# EAGLE design mosfet_out (EAGLE 7.2.0)
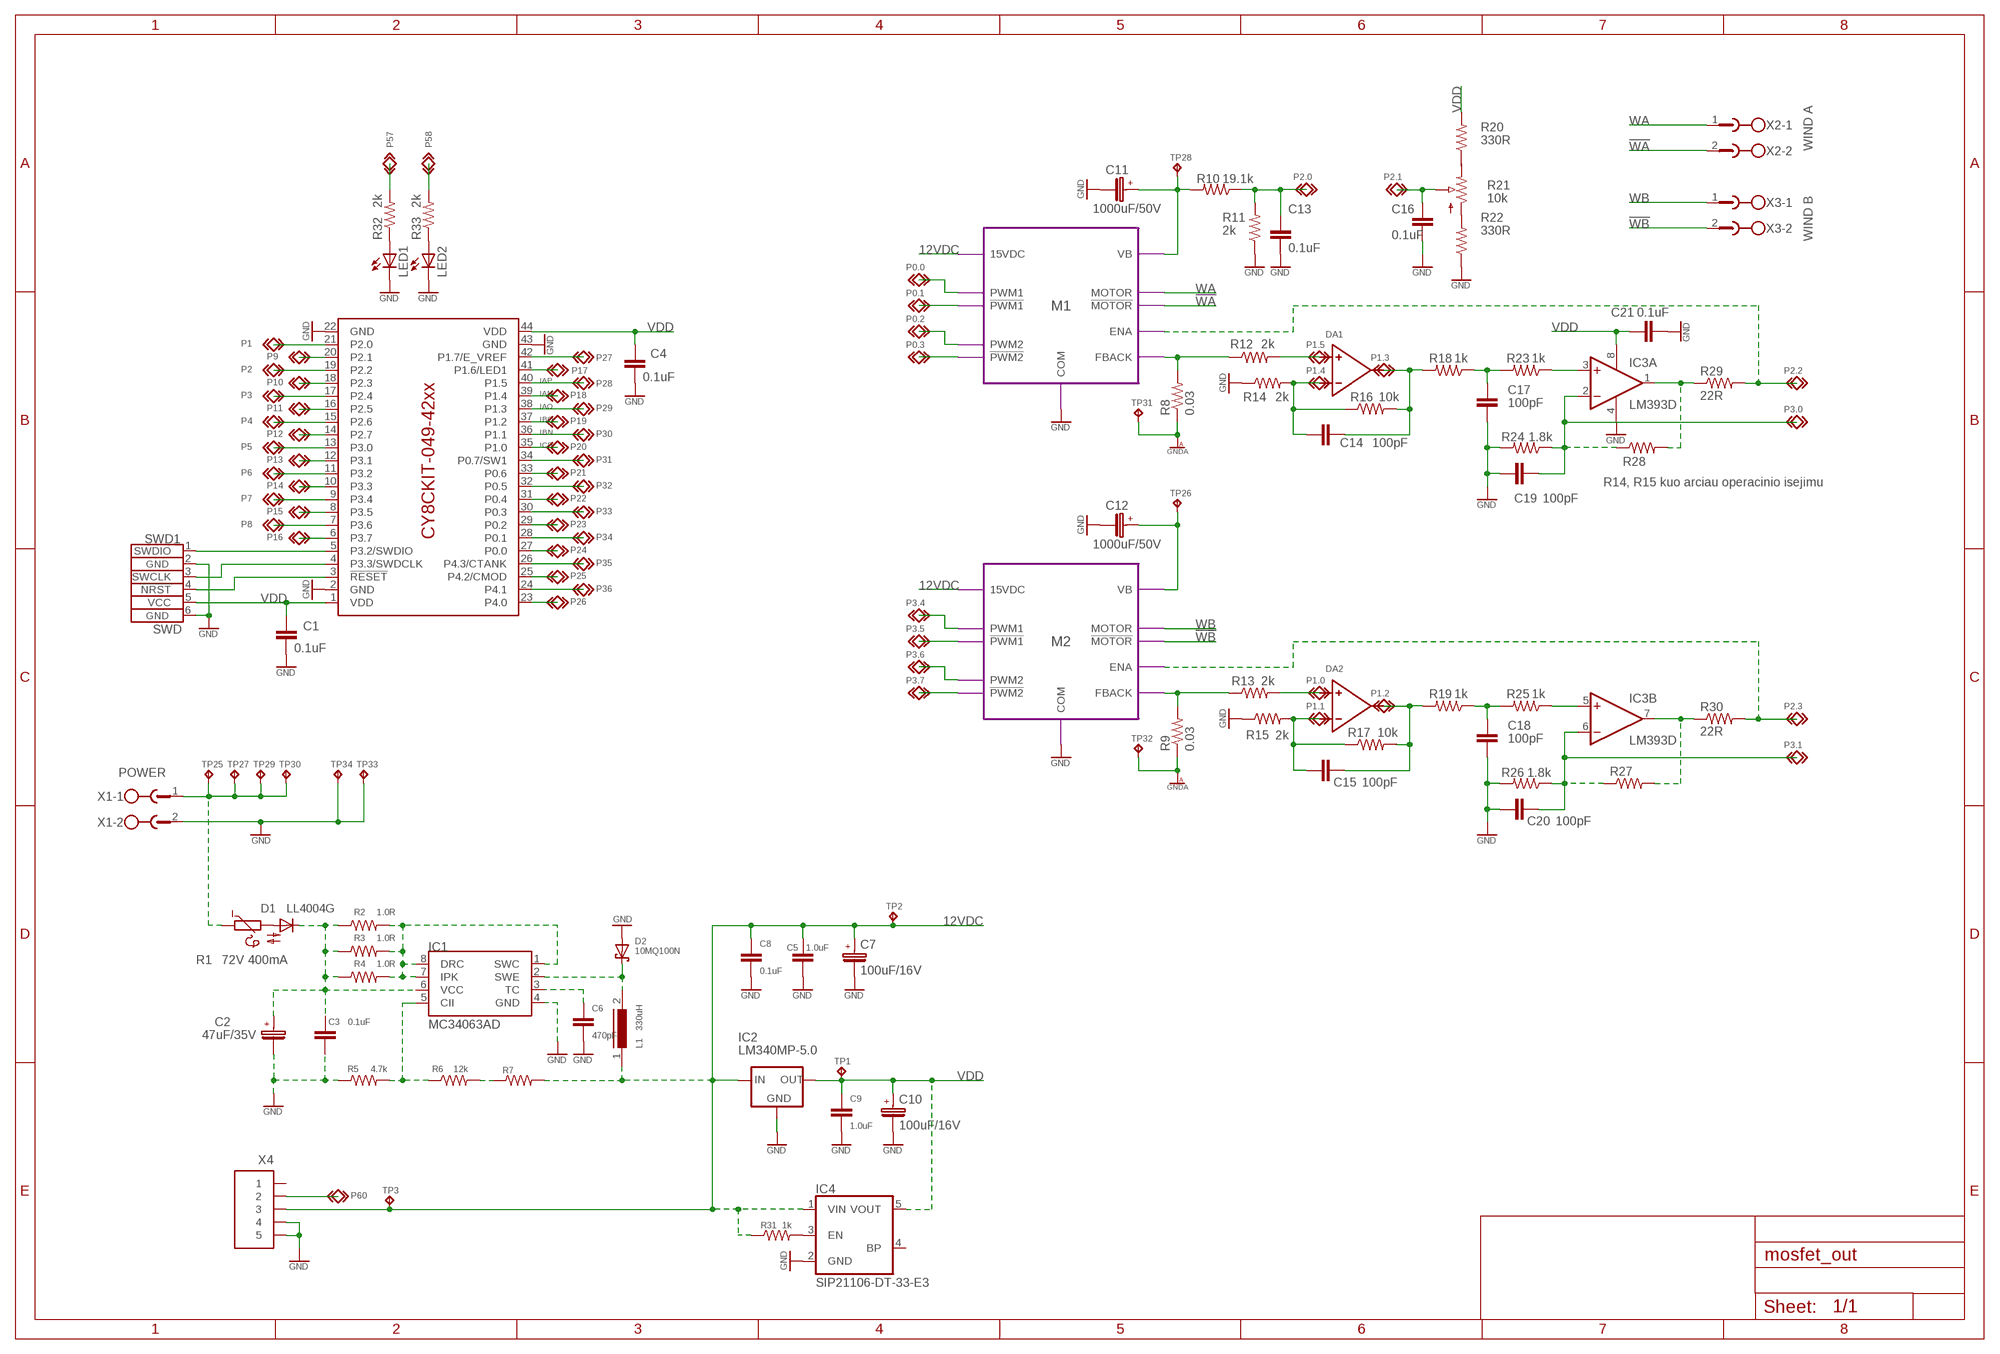
[diagram p0: schematic, sheet 1]

## Parts
C1  0.1uF  C0805-0.1UF  [C0805]
C2  47uF/35V  CPOL/2.5X6-47UF/35V  [E2,5-6]
C3  0.1uF  C0805-0.1UF  [C0805]
C4  0.1uF  C0805-0.1UF  [C0805]
C5  1.0uF  C1206-1UF  [C1206]
C6  470pF  C0805-470PF  [C0805]
C7  100uF/16V  CPOL/2.5X6-100UF/16V  [E2,5-6]
C8  0.1uF  C0805-0.1UF  [C0805]
C9  1.0uF  C1206-1UF  [C1206]
C10  100uF/16V  CPOL/2.5X6-100UF/16V  [E2,5-6]
C11  1000uF/50V  CPOL/5X13-1000UF/50V  [E5-13]
C12  1000uF/50V  CPOL/5X13-1000UF/50V  [E5-13]
C13  0.1uF  C0805-0.1UF  [C0805]
C14  100pF  C0805-100PF  [C0805]
C15  100pF  C0805-100PF  [C0805]
C16  0.1uF  C0805-0.1UF  [C0805]
C17  100pF  C0805-100PF  [C0805]
C18  100pF  C0805-100PF  [C0805]
C19  100pF  C0805-100PF  [C0805]
C20  100pF  C0805-100PF  [C0805]
C21  0.1uF  C0805-0.1UF  [C0805]
D1  LL4004G  DSW-LL4004/MELF  [MELF-MLL41]
D2  10MQ100N  DSH-10MQ100/DO214AC  [DO214AC]
IC1  MC34063AD  [SO08]
IC2  LM340MP-5.0  LM340  [SOT223]
IC3  LM393D  [SO08]
IC4  SIP21106-DT-33-E3  SIP21106DT  [SOT25]
L1  330uH  LSDR7045-330UH  [DR7045]
LED1  LED-GREEN-3MM  [LED3MM]
LED2  LED-GREEN-3MM  [LED3MM]
P0.0  CONT_1.2MM  [TP1.2X1.2]
P0.1  CONT_1.2MM  [TP1.2X1.2]
P0.2  CONT_1.2MM  [TP1.2X1.2]
P0.3  CONT_1.2MM  [TP1.2X1.2]
P1  CONT_1.5MM  [TP1.5X1.5]
P1.0  CONT_1.2MM  [TP1.2X1.2]
P1.1  CONT_1.2MM  [TP1.2X1.2]
P1.2  CONT_1.2MM  [TP1.2X1.2]
P1.3  CONT_1.2MM  [TP1.2X1.2]
P1.4  CONT_1.2MM  [TP1.2X1.2]
P1.5  CONT_1.2MM  [TP1.2X1.2]
P2  CONT_1.5MM  [TP1.5X1.5]
P2.0  CONT_1.5MM  [TP1.5X1.5]
P2.1  CONT_1.5MM  [TP1.5X1.5]
P2.2  CONT_1.2MM  [TP1.2X1.2]
P2.3  CONT_1.2MM  [TP1.2X1.2]
P3  CONT_1.5MM  [TP1.5X1.5]
P3.0  CONT_1.2MM  [TP1.2X1.2]
P3.1  CONT_1.2MM  [TP1.2X1.2]
P3.4  CONT_1.2MM  [TP1.2X1.2]
P3.5  CONT_1.2MM  [TP1.2X1.2]
P3.6  CONT_1.2MM  [TP1.2X1.2]
P3.7  CONT_1.2MM  [TP1.2X1.2]
P4  CONT_1.5MM  [TP1.5X1.5]
P5  CONT_1.5MM  [TP1.5X1.5]
P6  CONT_1.5MM  [TP1.5X1.5]
P7  CONT_1.5MM  [TP1.5X1.5]
P8  CONT_1.5MM  [TP1.5X1.5]
P9  CONT_1.5MM  [TP1.5X1.5]
P10  CONT_1.5MM  [TP1.5X1.5]
P11  CONT_1.5MM  [TP1.5X1.5]
P12  CONT_1.5MM  [TP1.5X1.5]
P13  CONT_1.5MM  [TP1.5X1.5]
P14  CONT_1.5MM  [TP1.5X1.5]
P15  CONT_1.5MM  [TP1.5X1.5]
P16  CONT_1.5MM  [TP1.5X1.5]
P17  CONT_1.5MM  [TP1.5X1.5]
P18  CONT_1.5MM  [TP1.5X1.5]
P19  CONT_1.5MM  [TP1.5X1.5]
P20  CONT_1.5MM  [TP1.5X1.5]
P21  CONT_1.5MM  [TP1.5X1.5]
P22  CONT_1.5MM  [TP1.5X1.5]
P23  CONT_1.5MM  [TP1.5X1.5]
P24  CONT_1.5MM  [TP1.5X1.5]
P25  CONT_1.5MM  [TP1.5X1.5]
P26  CONT_1.5MM  [TP1.5X1.5]
P27  CONT_1.5MM  [TP1.5X1.5]
P28  CONT_1.5MM  [TP1.5X1.5]
P29  CONT_1.5MM  [TP1.5X1.5]
P30  CONT_1.5MM  [TP1.5X1.5]
P31  CONT_1.5MM  [TP1.5X1.5]
P32  CONT_1.5MM  [TP1.5X1.5]
P33  CONT_1.5MM  [TP1.5X1.5]
P34  CONT_1.5MM  [TP1.5X1.5]
P35  CONT_1.5MM  [TP1.5X1.5]
P36  CONT_1.5MM  [TP1.5X1.5]
P57  CONT_1.5MM  [TP1.5X1.5]
P58  CONT_1.5MM  [TP1.5X1.5]
P60  CONT_1.5MM  [TP1.5X1.5]
R1  72V 400mA  POLYSW-RXE040/B57164  [B57164]
R2  1.0R  R1206-1.0R-1%  [R1206]
R3  1.0R  R1206-1.0R-1%  [R1206]
R4  1.0R  R1206-1.0R-1%  [R1206]
R5  4.7k  R0805-4.7K-1%  [R0805]
R6  12k  R0805-12K-1%  [R0805]
R7  R-US_R0805  [R0805]
R8  0.03  R-US_0309/12  [0309/12]
R9  0.03  R-US_0309/12  [0309/12]
R10  19.1k  R-US_R1206  [R1206]
R11  2k  R0805-2K-1%  [R0805]
R12  2k  R0805-2K-1%  [R0805]
R13  2k  R0805-2K-1%  [R0805]
R14  2k  R0805-2K-1%  [R0805]
R15  2k  R0805-2K-1%  [R0805]
R16  10k  R0805-10K-1%  [R0805]
R17  10k  R0805-10K-1%  [R0805]
R18  1k  R0805-1K-1%  [R0805]
R19  1k  R0805-1K-1%  [R0805]
R20  330R  R0805-330R-1%  [R0805]
R21  10k  TRIM_US-CA6V  [CA6V]
R22  330R  R0805-330R-1%  [R0805]
R23  1k  R0805-1K-1%  [R0805]
R24  1.8k  R-US_R0805  [R0805]
R25  1k  R0805-1K-1%  [R0805]
R26  1.8k  R-US_R0805  [R0805]
R27  R-US_R0805  [R0805]
R28  R-US_R0805  [R0805]
R29  22R  R0805-22R-1%  [R0805]
R30  22R  R0805-22R-1%  [R0805]
R31  1k  R0805-1K-1%  [R0805]
R32  2k  R0805-2K-1%  [R0805]
R33  2k  R0805-2K-1%  [R0805]
SWD1  SWD  [ISP]
TP1  TPB1,27  [B1,27]
TP2  TPB1,27  [B1,27]
TP3  TPTP15SQ  [TP15SQ]
TP25  TPTP20SQ  [TP20SQ]
TP26  TPTP20SQ  [TP20SQ]
TP27  TPTP20SQ  [TP20SQ]
TP28  TPTP20SQ  [TP20SQ]
TP29  TPTP20SQ  [TP20SQ]
TP30  TPTP20SQ  [TP20SQ]
TP31  TPTP20SQ  [TP20SQ]
TP32  TPTP20SQ  [TP20SQ]
TP33  TPTP20SQ  [TP20SQ]
TP34  TPTP20SQ  [TP20SQ]
U1  CY8CKIT-049-42XX  [CY8CKIT-049-42XX]
X1  POWER  MSTBV2  [MSTBV2]
X2  WIND A  MSTBV2  [MSTBV2]
X3  WIND B  MSTBV2  [MSTBV2]
X4  5PIN_NS25-W5P  [6410-05]

## Module instances
M1 = M1
M2 = M1

## Nets
12VDC [power]: C5.1 C7.+ C8.1 IC2.1(IN) IC4.1(VIN) L1.1 R7.2 R31.1 TP2.PP(TP) TP3.TP X4.3 ; port M1.15VDC M2.15VDC
!WA [power+]: X2.2 ; port M1.!MOTOR
!WB [power+]: X3.2 ; port M2.!MOTOR
GND: C1.2 C2.- C3.2 C4.2 C5.2 C6.2 C7.- C8.2 C9.2 C10.- C11.- C12.- C13.2 C16.2 C17.2 C18.2 C19.2 C20.2 C21.2 D2.A IC1.4(GND) IC2.2(GND) IC2.4(GND) IC3.4(P:V-) IC4.2(GND) LED1.C LED2.C R5.1 R11.1 R14.1 R15.1 R22.1 R24.2 R26.2 SWD1.2(GND) SWD1.6(GND) TP33.TP TP34.TP U1.2(GND) U1.22(GND) U1.43(GND) X1.2 X4.4 X4.5 ; port M1.COM M2.COM
GNDA [power+]: R8.1 R9.1 TP31.TP TP32.TP
IA [power+]: R8.2 R12.1 ; port M1.FBACK
IA_KILL: P2.2.P R29.2 ; port M1.ENA
IAN: C14.2 P1.4.P P18.P R14.2 R16.1 U1.39(P1.4)
IAO: C14.1 P1.3.P P29.P R16.2 R18.2 U1.38(P1.3)
IAP: P28.P U1.40(P1.5)
IAREF: C19.1 IC3.2(A:-IN) P3.0.P R24.1 R28.1
IB [power+]: R9.2 R13.1 ; port M2.FBACK
IB_KILL: P2.3.P R30.2 ; port M2.ENA
IBN: C15.2 P1.1.P P30.P R15.2 R17.1 U1.36(P1.1)
IBO: C15.1 P1.2.P P19.P R17.2 R19.2 U1.37(P1.2)
IBREF: C20.1 IC3.6(B:-IN) P3.1.P R26.1 R27.1
ICP: P20.P U1.35(P1.0)
N$1: IC3.7(B:OUT) R27.2 R30.1
N$2: SWD1.1(SWDIO) U1.5(P3.2/SWDIO)
N$3: IC3.1(A:OUT) R28.2 R29.1
N$4: SWD1.3(SWCLK) U1.4(P3.3/SWDCLK)
N$5: IC3.3(A:+IN) R23.1
N$6: IC3.5(B:+IN) R25.1
N$7: SWD1.4(!NRST) U1.3(!RESET)
N$8: R21.A R22.2
N$9 [power]: IC1.1(SWC) IC1.7(IPK) IC1.8(DRC) R2.2 R3.2 R4.2
N$10: IC1.5(CII) R5.2 R6.1
N$11: C6.1 IC1.3(TC)
N$12: R6.2 R7.1
N$13 [power]: C2.+ C3.1 D1.C IC1.6(VCC) R2.1 R3.1 R4.1
N$14: R20.1 R21.E
N$15 [power]: D1.A R1.2
N$16 [power]: D2.C IC1.2(SWE) L1.2
N$17: C17.1 R18.1 R23.2
N$18: C18.1 R19.1 R25.2
N$19: P1.5.P R12.2
N$20: P1.0.P R13.2
N$21: P0.0.P ; port M1.PWM1
N$22: IC4.3(EN) R31.2
N$23: LED1.A R32.1
N$24: LED2.A R33.1
N$25: P0.1.P ; port M1.!PWM1
N$26: P0.2.P ; port M1.PWM2
N$27: P0.3.P ; port M1.!PWM2
N$28: P3.4.P ; port M2.PWM1
N$29: P3.5.P ; port M2.!PWM1
N$30: P3.6.P ; port M2.PWM2
N$31: P3.P U1.17(P2.4)
N$31.: P3.7.P ; port M2.!PWM2
N$33: P57.P R32.2
N$34: P58.P R33.2
N$35: P1.P U1.21(P2.0)
N$36: P9.P U1.20(P2.1)
N$37: P2.P U1.19(P2.2)
N$38: P10.P U1.18(P2.3)
N$39: P11.P U1.16(P2.5)
N$40: P4.P U1.15(P2.6)
N$41: P12.P U1.14(P2.7)
N$42: P5.P U1.13(P3.0)
N$43: P13.P U1.12(P3.1)
N$44: P6.P U1.11(P3.2)
N$45: P14.P U1.10(P3.3)
N$46: P7.P U1.9(P3.4)
N$47: P15.P U1.8(P3.5)
N$48: P8.P U1.7(P3.6)
N$49: P16.P U1.6(P3.7)
N$50: P26.P U1.23(P4.0)
N$51: P36.P U1.24(P4.1)
N$52: P25.P U1.25(P4.2/CMOD)
N$53: P35.P U1.26(P4.3/CTANK)
N$54: P24.P U1.27(P0.0)
N$55: P34.P U1.28(P0.1)
N$56: P23.P U1.29(P0.2)
N$57: P33.P U1.30(P0.3)
N$58: P22.P U1.31(P0.4)
N$59: P32.P U1.32(P0.5)
N$60: P21.P U1.33(P0.6)
N$61: P31.P U1.34(P0.7/SW1)
N$63: P60.P X4.2
N$68: P17.P U1.41(P1.6/LED1)
N$69: P27.P U1.42(P1.7/E_VREF)
SPEED: C16.1 P2.1.P R21.S
VB [power+]: C11.+ C12.+ R1.1 R10.2 TP25.TP TP26.TP TP27.TP TP28.TP TP29.TP TP30.TP X1.1 ; port M1.VB M2.VB
VBUS: C13.1 P2.0.P R10.1 R11.2
VDD [power]: C1.1 C4.1 C9.1 C10.+ C21.1 IC2.3(OUT) IC3.8(P:V+) IC4.5(VOUT) R20.2 SWD1.5(VCC) TP1.PP(TP) U1.1(VDD) U1.44(VDD)
WA [power+]: X2.1 ; port M1.MOTOR
WB [power+]: X3.1 ; port M2.MOTOR
Unconnected: IC4.4(BP) X4.1

## Notes on the sheet
- R14, R15 kuo arciau operacinio isejimu

## Library data of the parts
C1 C3 C4 C8 C13 C16 C21 = discr_lib:C?: Kondensatorius; PACK_TYPE: SMD; TYPE: X7R; VENT_CODE: ZKN065
C2 = discr_lib:CPOL?: Kondensatorius elektrolitinis; PACK_TYPE: DIP; VENT_CODE: ---
C5 C9 = discr_lib:C?: Kondensatorius; PACK_TYPE: SMD; TYPE: X7R; U: 16V; VENT_CODE: ZKN062
C6 = discr_lib:C?: Kondensatorius; PACK_TYPE: SMD; TYPE: X7R; U: 50V; VENT_CODE: ZKN087
C7 C10 = discr_lib:CPOL?: Kondensatorius elektrolitinis; PACK_TYPE: DIP; VENT_CODE: ZKN008
C11 C12 = discr_lib:CPOL?: Kondensatorius elektrolitinis; PACK_TYPE: DIP; VENT_CODE: ZKN056
C14 C15 C17-C20 = discr_lib:C?: Kondensatorius; PACK_TYPE: SMD; U: 50V; VENT_CODE: ---
D1 = discr_lib:DSW*: Diodas; PACK_TYPE: SMD; TYPE: Switch; VENT_CODE: ZELD019
D2 = discr_lib:DSH*: Shottky diodas; PACK_TYPE: SMD; PARAMS: 100V 2.1A; VENT_CODE: ZELD046
IC1 = linear_lib:MC34063: Step Up/Down impulsinio maitinimo saltinio draiveris; PACK_TYPE: SMD; VENT_CODE: ZELM041
IC2 = v-reg:LM340: Stabilizatorius; PACK_TYPE: SMD; VENT_CODE: ZELM013
IC3 = linear:LM393: Komparatorius; PACK_TYPE: SMD; VENT_CODE: ---
IC4 = v-reg:SIP2110*?: Stabilizatorius; MARK: N3; PACK_TYPE: SMD; VENT_CODE: ZELM092
L1 = discr_lib:L?: Droselis; PACK_TYPE: SMD; VENT_CODE: ZELI009
LED1 LED2 = discr_lib:LED*: Sviesos diodas; PACK_TYPE: DIP; PARAMS: Green; VENT_CODE: ZELD006
P0.0 P0.1-P0.3 P1 P1.0 P1.1-P1.5 P2 P2.0 P2.1-P2.3 P3 P3.0 P3.1 P3.4-P3.7 P4-P36 P57 P58 P60 = misc:CONT_*
R1 = discr_lib:POLYSW*: Atsistatamtis saugiklis; PACK_TYPE: DIP; VENT_CODE: ZEL062
R2-R4 = discr_lib:R?: Rezistorius; DIFF: 1%; PACK_TYPE: SMD; VENT_CODE: ZELRS019
R5 = discr_lib:R?: Rezistorius; DIFF: 1%; PACK_TYPE: SMD; VENT_CODE: ZELRS053
R6 = discr_lib:R?: Rezistorius; DIFF: 1%; PACK_TYPE: SMD; VENT_CODE: ZELRS062
R7 = rcl:R-US_: Rezistorius; PACK_TYPE: SMD
R8 R9 = rcl:R-US_: Rezistorius; PACK_TYPE: DIP; VENT_CODE: ---
R10 R24 R26-R28 = rcl:R-US_: Rezistorius; PACK_TYPE: SMD; VENT_CODE: ---
R11-R15 R32 R33 = discr_lib:R?: Rezistorius; DIFF: 1%; PACK_TYPE: SMD; VENT_CODE: ZELRS063
R16 R17 R29 R30 = discr_lib:R?: Rezistorius; DIFF: 1%; PACK_TYPE: SMD; VENT_CODE: ---
R18 R19 R23 R25 R31 = discr_lib:R?: Rezistorius; DIFF: 1%; PACK_TYPE: SMD; VENT_CODE: ZELRS061
R20 R22 = discr_lib:R?: Rezistorius; DIFF: 1%; PACK_TYPE: SMD; VENT_CODE: ZELRS018
R21 = pot:TRIM_US-: POTENTIOMETER
SWD1 = connectors:SWD: Jungtis; PACK_TYPE: DIP; VENT_CODE: ---
TP1-TP3 TP25-TP34 = testpad:TP: Test pad
U1 = cypress:CY8CKIT-049-42XX
X1-X3 = con-phoenix-508:MSTBV2: PHOENIX
X4 = connectors:5PIN_

## Module M1
Ports: PWM1(in) !PWM1(in) MOTOR(out) !MOTOR(out) PWM2(in) !PWM2(in) COM(pas) FBACK(out) VB(pwr) 15VDC(pwr) ENA(in)
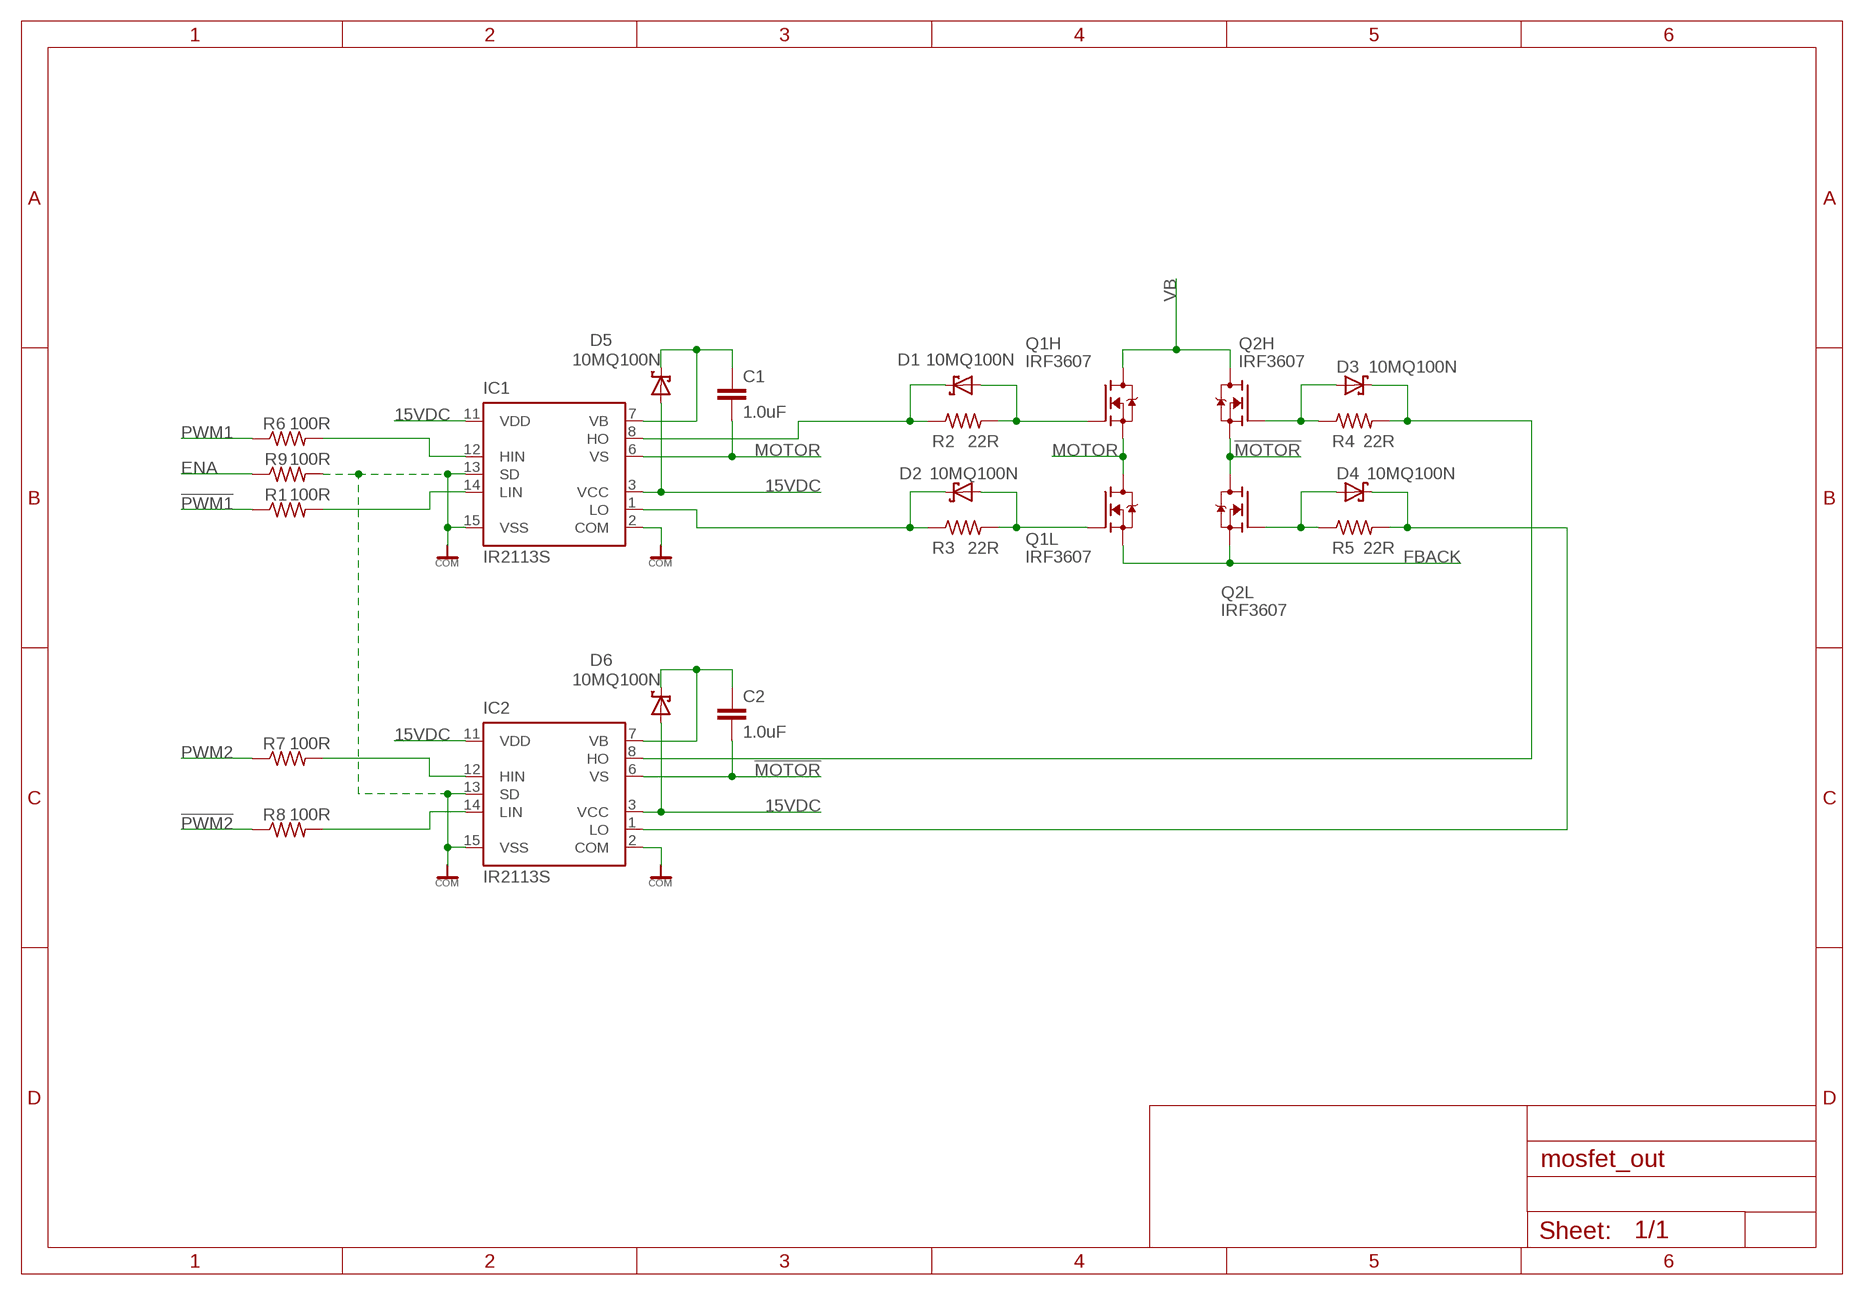
[diagram p1: schematic, module M1, sheet 1]

### Parts
C1  1.0uF  C1206-1UF  [C1206]
C2  1.0uF  C1206-1UF  [C1206]
D1  10MQ100N  DSH-10MQ100/DO214AC  [DO214AC]
D2  10MQ100N  DSH-10MQ100/DO214AC  [DO214AC]
D3  10MQ100N  DSH-10MQ100/DO214AC  [DO214AC]
D4  10MQ100N  DSH-10MQ100/DO214AC  [DO214AC]
D5  10MQ100N  DSH-10MQ100/DO214AC  [DO214AC]
D6  10MQ100N  DSH-10MQ100/DO214AC  [DO214AC]
IC1  IR2113S  [SO16L]
IC2  IR2113S  [SO16L]
Q1H  IRF3607  [D-PAK_TO252AA]
Q1L  IRF3607  [D-PAK_TO252AA]
Q2H  IRF3607  [D-PAK_TO252AA]
Q2L  IRF3607  [D-PAK_TO252AA]
R1  100R  R0805-100R-1%  [R0805]
R2  22R  R0805-22R-1%  [R0805]
R3  22R  R0805-22R-1%  [R0805]
R4  22R  R0805-22R-1%  [R0805]
R5  22R  R0805-22R-1%  [R0805]
R6  100R  R0805-100R-1%  [R0805]
R7  100R  R0805-100R-1%  [R0805]
R8  100R  R0805-100R-1%  [R0805]
R9  100R  R0805-100R-1%  [R0805]

### Nets
15VDC: D5.A D6.A IC1.3(VCC) IC1.11(VDD) IC2.3(VCC) IC2.11(VDD)
!MOTOR: C2.2 IC2.6(VS) Q2H.3(S) Q2L.4(D)
!PWM1: R1.1
!PWM2: R8.1
AH: D1.C IC1.8(HO) R2.1
AL: D2.C IC1.1(LO) R3.1
BH: D3.C IC2.8(HO) R4.2
BL: D4.C IC2.1(LO) R5.2
COM: IC1.2(COM) IC1.13(SD) IC1.15(VSS) IC2.2(COM) IC2.13(SD) IC2.15(VSS) R9.2
ENA: R9.1
FBACK: Q1L.3(S) Q2L.3(S)
MOTOR: C1.2 IC1.6(VS) Q1H.3(S) Q1L.4(D)
N$1 [power]: C2.1 D6.C IC2.7(VB)
N$2 [power]: C1.1 D5.C IC1.7(VB)
N$3: IC1.14(LIN) R1.2
N$4: IC1.12(HIN) R6.2
N$5: D1.A Q1H.1(G) R2.2
N$6: IC2.12(HIN) R7.2
N$7: D2.A Q1L.1(G) R3.2
N$8: IC2.14(LIN) R8.2
N$9: D3.A Q2H.1(G) R4.1
N$11: D4.A Q2L.1(G) R5.1
PWM1: R6.1
PWM2: R7.1
VB: Q1H.4(D) Q2H.4(D)

### Library data of the parts
C1 C2 = discr_lib:C?: Kondensatorius; PACK_TYPE: SMD; TYPE: X7R; U: 16V; VENT_CODE: ZKN062
D1-D6 = discr_lib:DSH*: Shottky diodas; PACK_TYPE: SMD; PARAMS: 100V 2.1A; VENT_CODE: ZELD046
IC1 IC2 = ir:IR211*: MOSFET draiveris; PACK_TYPE: SMD; VENT_CODE: ---
Q1H Q1L Q2H Q2L = transistor-fet:IRF?3607: MOSFET tranzistorius; PACK_TYPE: SMD; VENT_CODE: ---
R1 R6-R9 = discr_lib:R?: Rezistorius; DIFF: 1%; PACK_TYPE: SMD; VENT_CODE: ZELRS005
R2-R5 = discr_lib:R?: Rezistorius; DIFF: 1%; PACK_TYPE: SMD; VENT_CODE: ---

## Net classes
0 default: clearance 0.205 mm
1 power: clearance 0.305 mm to class 0, clearance 0.305 mm
2 power+: clearance 0.42 mm to class 0

## Board
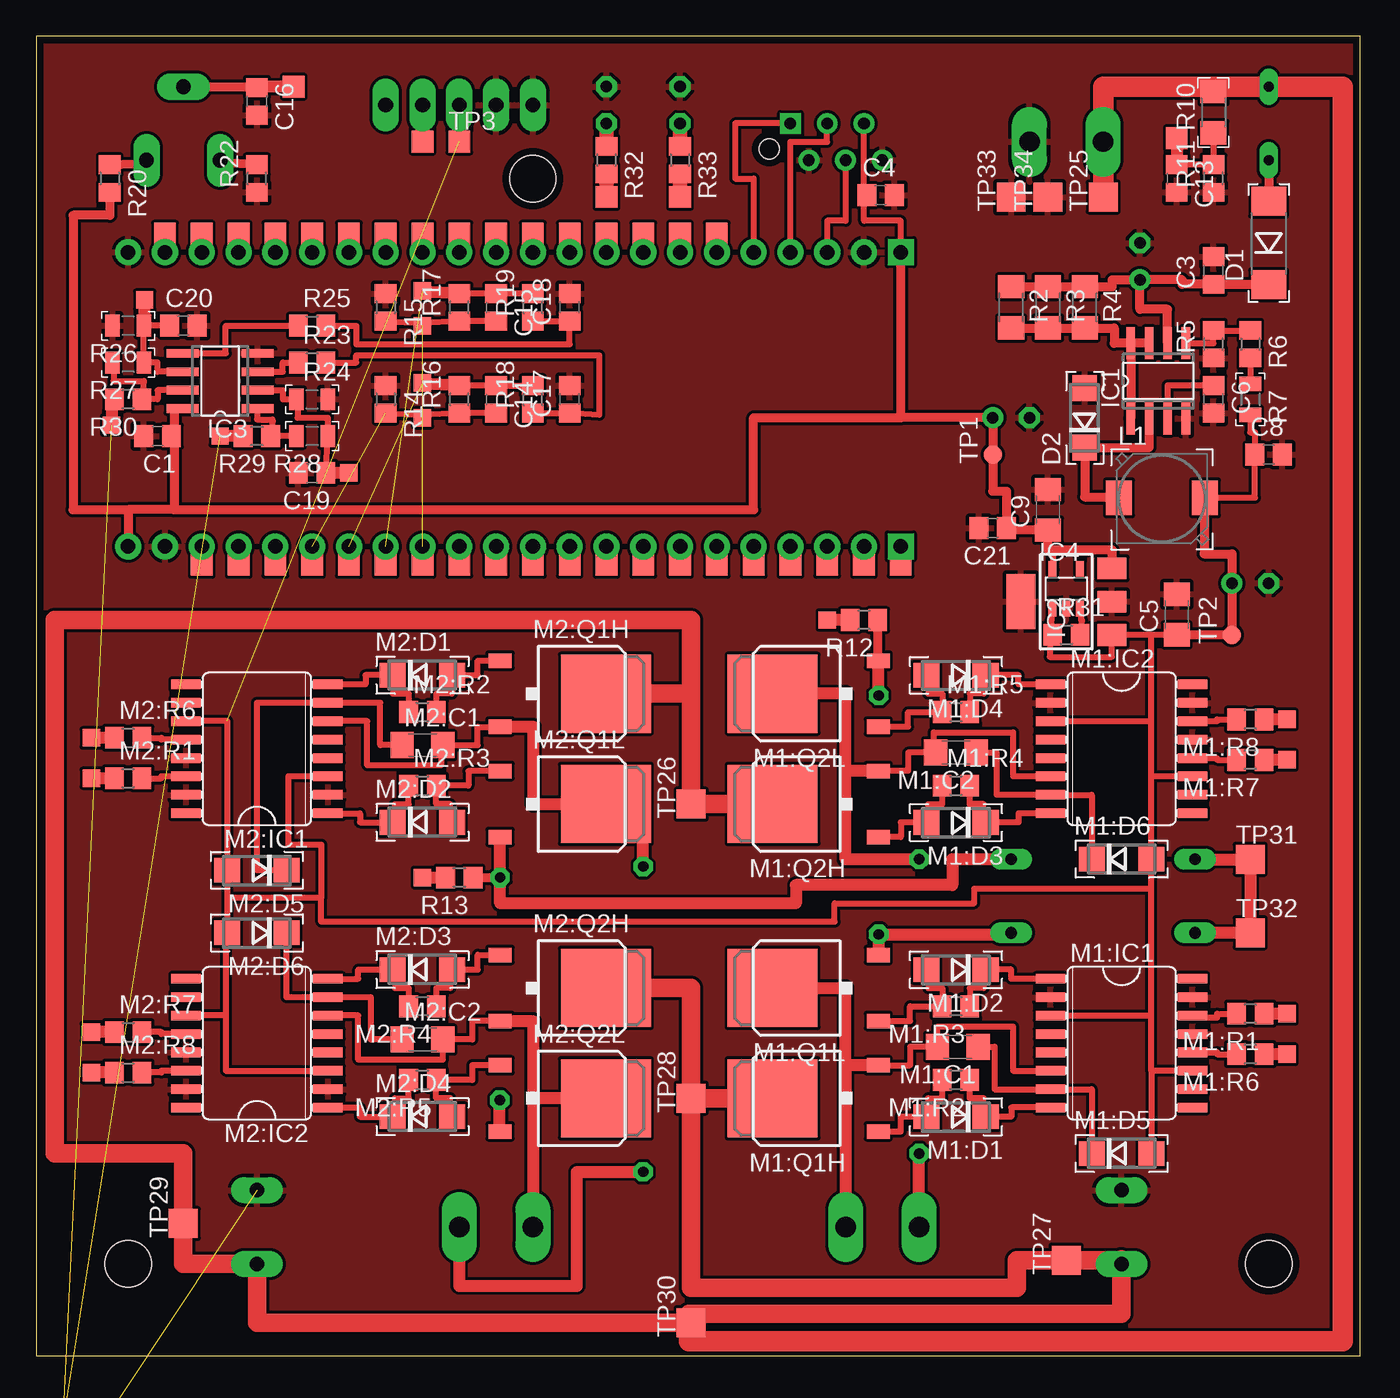
[diagram p2: board, top side]
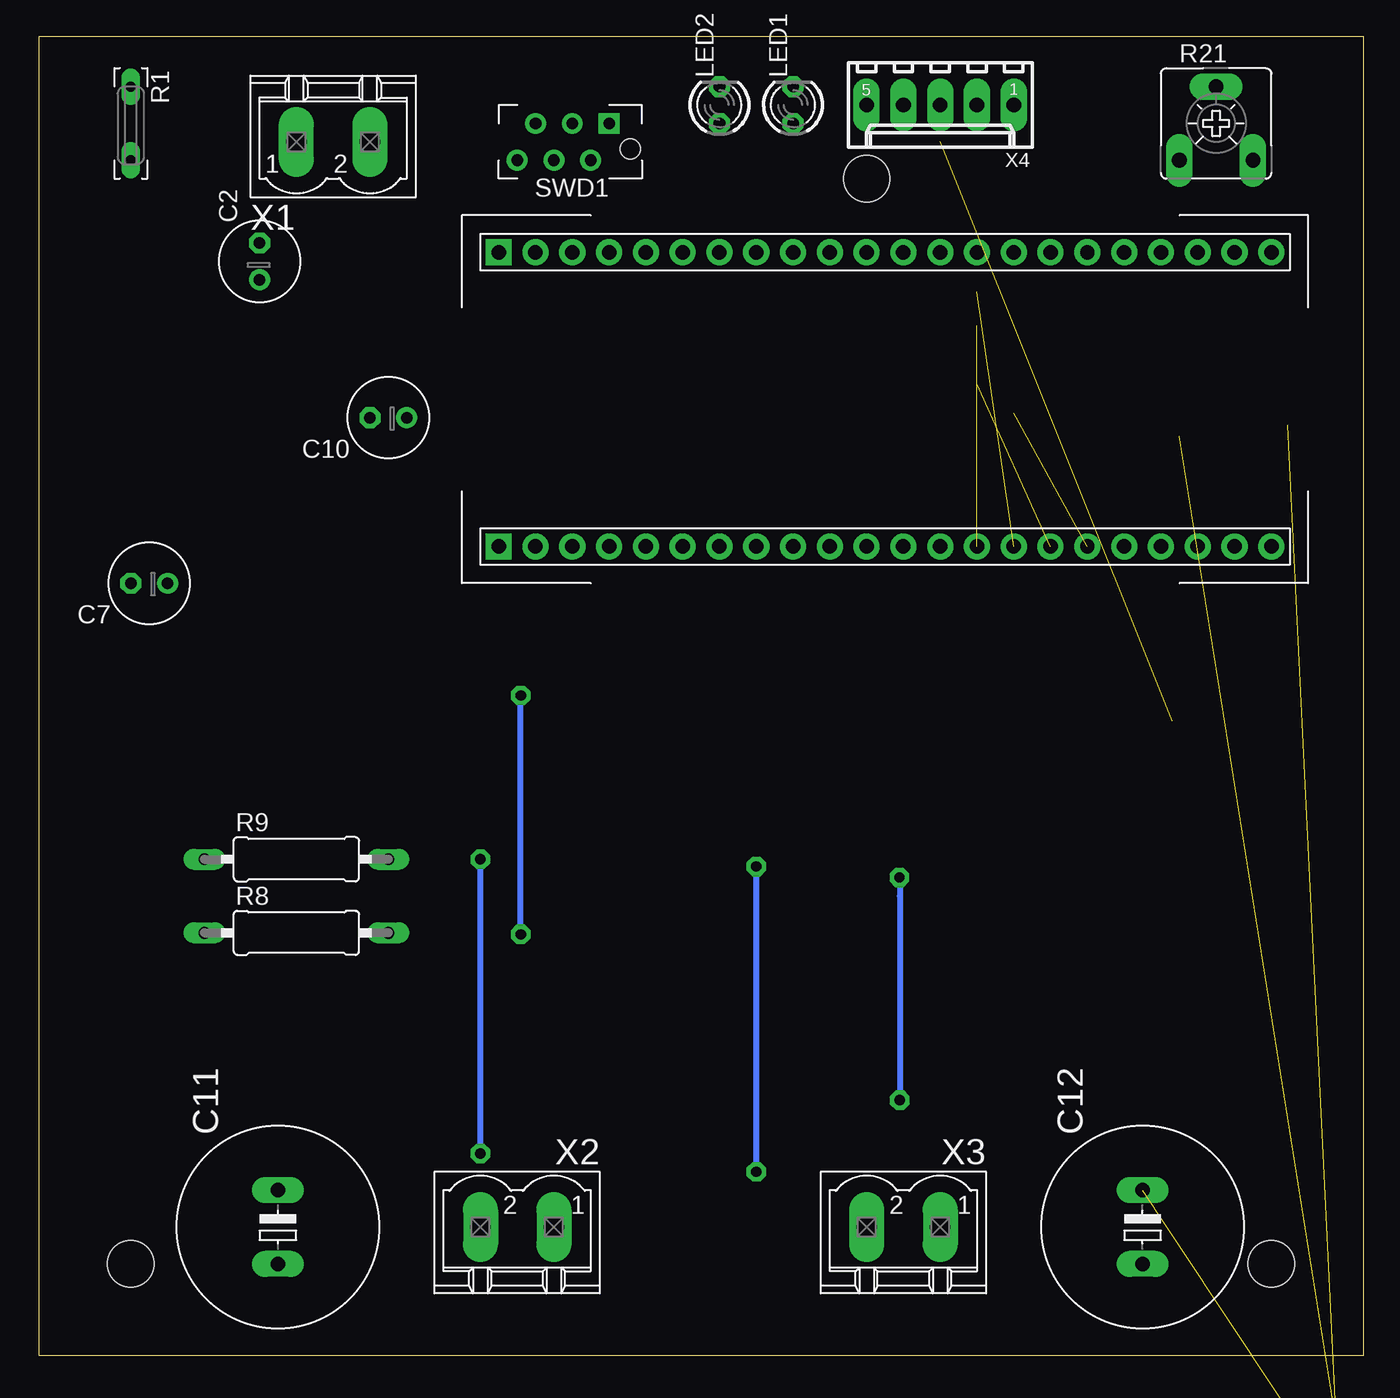
[diagram p3: board, bottom side, seen from below]

Size 91.42 x 91.11 mm. Coordinates in mm from the lower left corner, seen from the top.
Outline: 0,0 91.42,0 91.42,91.11 0,91.11 0,0
Copper layers (1*16): Top 0.035mm / dielectric 1.5mm / Bottom 0.035mm
Design rules "default *": minimum track width 10mil, minimum drill 24mil, track to track 8mil, track to pad 8mil, pad to pad 8mil, via to via 8mil, smd to smd 8mil, copper to edge 0.5mm, drill to drill 8mil, minimum pad ring 10mil, minimum via ring 8mil, stop-mask expansion 4mil, vias tented up to drill 0mil, thermal gap 10mil
Holes 3.2 mm at 6.35,6.35 85.09,6.35 85.09,6.35 34.29,81.28

### Footprints (pad centres in the part's own frame; a part is rotated, then mirrored left to right if it is on the bottom)
C0805 = smd 1.3 x 1.5: 1 -0.95,0; 2 0.95,0
E2,5-6 = drill 0.8: + -1.27,0 | drill 0.8 octagon: - 1.27,0
C1206 = smd 1.6 x 1.8: 1 -1.4,0; 2 1.4,0
E5-13 = drill 1 long: + -2.54,0; - 2.54,0
MELF-MLL41 = smd 2 x 2.4: A 2.879,0; C -2.879,0
DO214AC = smd 1.8 x 1.7: A 2.05,0; C -2.05,0
SO08 = smd 0.6 x 2.2: 1 -1.905,-2.6; 2 -0.635,-2.6; 3 0.635,-2.6; 4 1.905,-2.6; 5 1.905,2.6; 6 0.635,2.6; 7 -0.635,2.6; 8 -1.905,2.6
SOT223 = smd 1.5 x 2: 1 -2.3,-3.15; 2 0,-3.15; 3 2.3,-3.15 | smd 3.8 x 2: 4 0,3.15
SOT25 = smd 0.55 x 1.2: 1 -0.95,-1.3; 2 0,-1.3; 3 0.95,-1.3; 4 0.95,1.3; 5 -0.95,1.3
DR7045 = smd 2.4 x 1.8: 1 -0.063,2.967; 2 -0.064,-2.967
LED3MM = drill 0.8 pad 1.422 octagon: A -1.27,0; C 1.27,0
SO16L = smd 0.66 x 2.032: 1 -4.445,-4.902; 2 -3.175,-4.902; 3 -1.905,-4.902; 4 -0.635,-4.902; 5 0.635,-4.902; 6 1.905,-4.902; 7 3.175,-4.902; 8 4.445,-4.902; 9 4.445,4.902; 10 3.175,4.902; 11 1.905,4.902; 12 0.635,4.902; 13 -0.635,4.902; 14 -1.905,4.902; 15 -3.175,4.902; 16 -4.445,4.902
D-PAK_TO252AA = smd 1 x 1.6: 1 -2.28,-4.8; 3 2.28,-4.8 | smd 5.4 x 6.2: 4 0,2.5
R0805 = smd 1.3 x 1.5: 1 -0.95,0; 2 0.95,0
TP1.2X1.2 = smd 1.2 x 1.2: P 0,0
TP1.5X1.5 = smd 1.5 x 1.5: P 0,0
B57164 = drill 0.7 long: 1 -2.54,0; 2 2.54,0
R1206 = smd 1.6 x 1.803: 1 -1.422,0; 2 1.422,0
R0805' = smd 1 x 1.5: 1 -1.077,0; 2 1.077,0
0309/12 = drill 0.813 long: 1 -6.35,0; 2 6.35,0
CA6V = drill 1.016 long: A -2.54,-2.54; E 2.54,-2.54; S 0,2.54
ISP = drill 0.8 pad 1.422 square: 1 -2.54,-1.27 | drill 0.8 pad 1.422: 2 -1.27,1.27; 3 0,-1.27; 4 1.27,1.27; 5 2.54,-1.27; 6 3.81,1.27 | hole 1.4: -4,0.5
B1,27 = smd 1.27 x 1.27: PP 0,0
TP15SQ = smd 1.5 x 1.5: TP 0,0
TP20SQ = smd 2 x 2: TP 0,0
CY8CKIT-049-42XX = drill 1 square: 1 -10.16,-26.67; 23 10.16,-26.67 | drill 1: 2 -10.16,-24.13; 3 -10.16,-21.59; 4 -10.16,-19.05; 5 -10.16,-16.51; 6 -10.16,-13.97; 7 -10.16,-11.43; 8 -10.16,-8.89; 9 -10.16,-6.35; 10 -10.16,-3.81; 11 -10.16,-1.27; 12 -10.16,1.27; 13 -10.16,3.81; 14 -10.16,6.35; 15 -10.16,8.89; 16 -10.16,11.43; 17 -10.16,13.97; 18 -10.16,16.51; 19 -10.16,19.05; 20 -10.16,21.59; 21 -10.16,24.13; 22 -10.16,26.67; 24 10.16,-24.13; 25 10.16,-21.59; 26 10.16,-19.05; 27 10.16,-16.51; 28 10.16,-13.97; 29 10.16,-11.43; 30 10.16,-8.89; 31 10.16,-6.35; 32 10.16,-3.81; 33 10.16,-1.27; 34 10.16,1.27; 35 10.16,3.81; 36 10.16,6.35; 37 10.16,8.89; 38 10.16,11.43; 39 10.16,13.97; 40 10.16,16.51; 41 10.16,19.05; 42 10.16,21.59; 43 10.16,24.13; 44 10.16,26.67
MSTBV2 = drill 1.397 long: 1 -2.54,0; 2 2.54,0
6410-05 = drill 1.016 long: 1 -5.08,0; 2 -2.54,0; 3 0,0; 4 2.54,0; 5 5.08,0

### Placement (x,y rotation side)
C1  8.38,63.5 180 top
C2  76.2,75.56 90 bottom
C3  81.28,74.93 90 top
C4  58.29,80.14 0 top
C5  78.74,51.18 90 top
C6  81.28,66.04 270 top
C7  83.82,53.34 180 bottom
C8  85.09,62.23 0 top
C9  69.85,58.42 90 top
C10  67.31,64.77 180 bottom
C11  74.93,8.89 90 bottom
C12  15.24,8.89 90 bottom
C13  78.74,81.28 270 top
C14  31.75,66.04 270 top
C15  31.75,72.39 270 top
C16  15.24,86.61 270 top
C17  36.83,66.04 90 top
C18  36.83,72.39 90 top
C19  19.05,60.96 180 top
C20  10.16,71.12 0 top
C21  66.04,57.15 180 top
D1  85.09,76.83 90 top
D2  72.39,64.77 90 top
IC1  77.47,67.31 0 top
IC2  71.12,52.07 90 top
IC3  12.7,67.31 90 top
IC4  71.12,52.96 0 top
L1  77.72,59.18 270 top
LED1  39.37,86.36 90 bottom
LED2  44.45,86.36 90 bottom
M1:C1  1.0uF  [C1206]  63.63,21.34 180 top
M1:C2  1.0uF  [C1206]  63.5,41.66 180 top
M1:D1  10MQ100N  [DO214AC]  63.5,16.51 180 top
M1:D2  10MQ100N  [DO214AC]  63.5,26.67 180 top
M1:D3  10MQ100N  [DO214AC]  63.5,36.83 180 top
M1:D4  10MQ100N  [DO214AC]  63.5,46.99 180 top
M1:D5  10MQ100N  [DO214AC]  74.93,13.97 0 top
M1:D6  10MQ100N  [DO214AC]  74.93,34.29 0 top
M1:IC1  IR2113S  [SO16L]  74.93,21.59 270 top
M1:IC2  IR2113S  [SO16L]  74.93,41.91 270 top
M1:Q1H  IRF3607  [D-PAK_TO252AA]  53.34,17.78 90 top
M1:Q1L  IRF3607  [D-PAK_TO252AA]  53.34,25.4 90 top
M1:Q2H  IRF3607  [D-PAK_TO252AA]  53.34,38.1 90 top
M1:Q2L  IRF3607  [D-PAK_TO252AA]  53.34,45.72 90 top
M1:R1  100R  [R0805]  83.82,23.62 180 top
M1:R2  22R  [R0805]  63.5,19.05 180 top
M1:R3  22R  [R0805]  63.5,24.13 180 top
M1:R4  22R  [R0805]  63.5,39.37 0 top
M1:R5  22R  [R0805]  63.5,44.45 0 top
M1:R6  100R  [R0805]  83.82,20.83 180 top
M1:R7  100R  [R0805]  83.82,41.15 180 top
M1:R8  100R  [R0805]  83.82,43.94 180 top
M1:R9  100R  [R0805]  2.54,-6.35 0 top  (outside the outline)
M2:C1  1.0uF  [C1206]  26.67,42.16 0 top
M2:C2  1.0uF  [C1206]  26.67,21.84 0 top
M2:D1  10MQ100N  [DO214AC]  26.67,46.99 0 top
M2:D2  10MQ100N  [DO214AC]  26.67,36.83 0 top
M2:D3  10MQ100N  [DO214AC]  26.67,26.67 0 top
M2:D4  10MQ100N  [DO214AC]  26.67,16.51 0 top
M2:D5  10MQ100N  [DO214AC]  15.24,33.53 180 top
M2:D6  10MQ100N  [DO214AC]  15.24,29.21 180 top
M2:IC1  IR2113S  [SO16L]  15.24,41.91 90 top
M2:IC2  IR2113S  [SO16L]  15.24,21.59 90 top
M2:Q1H  IRF3607  [D-PAK_TO252AA]  36.83,45.72 270 top
M2:Q1L  IRF3607  [D-PAK_TO252AA]  36.83,38.1 270 top
M2:Q2H  IRF3607  [D-PAK_TO252AA]  36.83,25.4 270 top
M2:Q2L  IRF3607  [D-PAK_TO252AA]  36.83,17.78 270 top
M2:R1  100R  [R0805]  6.35,39.88 0 top
M2:R2  22R  [R0805]  26.67,44.45 0 top
M2:R3  22R  [R0805]  26.67,39.37 0 top
M2:R4  22R  [R0805]  26.67,24.13 180 top
M2:R5  22R  [R0805]  26.67,19.05 180 top
M2:R6  100R  [R0805]  6.35,42.67 0 top
M2:R7  100R  [R0805]  6.35,22.35 0 top
M2:R8  100R  [R0805]  6.35,19.56 0 top
M2:R9  100R  [R0805]  2.54,-10.16 0 top  (outside the outline)
P0.0  86.36,20.83 0 top
P0.1  86.36,23.62 0 top
P0.2  86.36,41.15 0 top
P0.3  86.36,43.94 0 top
P1  8.89,77.47 90 top
P1.0  26.67,33.02 0 top
P1.1  26.67,71.12 180 top
P1.2  26.67,73.53 180 top
P1.3  26.67,67.18 180 top
P1.4  26.67,64.77 180 top
P1.5  54.61,50.8 0 top
P2  13.97,77.47 90 top
P2.0  78.74,84.07 0 top
P2.1  17.78,87.63 0 top
P2.2  12.7,63.5 0 top
P2.3  5.21,64.26 0 top
P3  19.05,77.47 90 top
P3.0  21.59,60.96 0 top
P3.1  7.49,72.9 0 top
P3.4  3.81,42.67 0 top
P3.5  3.81,39.88 0 top
P3.6  3.81,22.35 0 top
P3.7  3.81,19.56 0 top
P4  24.13,77.47 90 top
P5  29.21,77.47 90 top
P6  34.29,77.47 90 top
P7  39.37,77.47 90 top
P8  44.45,77.47 90 top
P9  11.43,77.47 90 top
P10  16.51,77.47 90 top
P11  21.59,77.47 90 top
P12  26.67,77.47 90 top
P13  31.75,77.47 90 top
P14  36.83,77.47 90 top
P15  41.91,77.47 90 top
P16  46.99,77.47 90 top
P17  13.97,54.61 270 top
P18  19.05,54.61 270 top
P19  24.13,54.61 270 top
P20  29.21,54.61 270 top
P21  34.29,54.61 270 top
P22  39.37,54.61 270 top
P23  44.45,54.61 270 top
P24  49.53,54.61 270 top
P25  54.61,54.61 270 top
P26  59.69,54.61 270 top
P27  11.43,54.61 90 top
P28  16.51,54.61 270 top
P29  21.59,54.61 270 top
P30  26.67,54.61 270 top
P31  31.75,54.61 270 top
P32  36.83,54.61 270 top
P33  41.91,54.61 270 top
P34  46.99,54.61 270 top
P35  52.07,54.61 270 top
P36  57.15,54.61 270 top
P57  39.37,80.01 90 top
P58  44.45,80.01 90 top
P60  26.67,83.82 0 top
R1  85.09,85.09 270 bottom
R2  67.31,72.39 270 top
R3  69.85,72.39 270 top
R4  72.39,72.39 270 top
R5  81.28,69.85 90 top
R6  83.82,69.85 270 top
R7  [R0805']  83.82,66.04 270 top
R8  73.66,29.21 0 bottom
R9  73.66,34.29 0 bottom
R10  81.28,85.85 90 top
R11  81.28,81.28 90 top
R12  57.15,50.8 180 top
R13  29.21,33.02 180 top
R14  24.13,66.04 270 top
R15  24.13,72.39 270 top
R16  29.21,66.04 90 top
R17  29.21,72.39 90 top
R18  34.29,66.04 90 top
R19  34.29,72.39 90 top
R20  5.08,81.28 270 top
R21  10.16,85.09 0 bottom
R22  15.24,81.28 90 top
R23  19.05,68.58 0 top
R24  1.8k  [R0805']  19.05,66.04 0 top
R25  19.05,71.12 0 top
R26  1.8k  [R0805']  6.35,71.12 180 top
R27  [R0805']  6.35,68.58 180 top
R28  [R0805']  19.05,63.5 180 top
R29  15.24,63.5 180 top
R30  6.35,66.04 180 top
R31  71.12,49.78 0 top
R32  39.37,82.55 270 top
R33  44.45,82.55 270 top
SWD1  54.61,83.82 180 bottom
TP1  66.04,62.23 90 top
TP2  82.55,49.78 90 top
TP3  29.21,83.82 0 top
TP25  73.66,80.01 90 top
TP26  45.21,38.1 90 top
TP27  71.12,6.6 90 top
TP28  45.21,17.78 90 top
TP29  10.16,9.14 90 top
TP30  45.21,2.29 90 top
TP31  83.82,34.29 0 top
TP32  83.82,29.21 0 top
TP33  67.31,80.01 90 top
TP34  69.85,80.01 90 top
U1  33.02,66.04 270 bottom
X1  71.12,83.82 0 bottom
X2  58.42,8.89 180 bottom
X3  31.75,8.89 180 bottom
X4  29.21,86.36 180 bottom

### Tracks (layer width: path | path; a pad name or v marks a point on that pad's centre or on a via)
12VDC  (1 unrouted)
  Top 0.406: 76.96,23.5 76.96,19.68 76.98,19.68 | M1:IC1.11 76.98,19.68 | M1:IC2.11 76.96,40.01 | 76.96,40.01 76.96,34.29 | M1:IC2.3 76.96,43.81 | 76.96,43.81 76.96,40.01 | M1:IC1.3 76.96,23.5 | 13.08,23.5 13.08,29.21 M2:D6.A 13.19,31.62 | 13.08,23.5 M2:IC2.11 | 13.08,23.5 13.08,19.68 M2:IC2.3 | M2:IC1.11 13.19,43.81 M2:D5.A 13.19,31.62 | 76.96,34.29 M1:D6.A | 19.68,31.62 19.68,29.97 55.12,29.97 55.12,31.24 64.77,31.24 64.77,32.26 76.96,32.26 | 19.68,31.62 13.19,31.62 | 76.96,32.26 76.96,23.5 | 76.98,19.68 M1:D5.A | R7.2 83.82,63.75 84.14,63.75 C8.1 84.14,59.24 L1.1 | C5.1 76.96,49.78 | 76.96,49.78 74.27,49.78 | 76.96,49.78 76.96,43.81 | 76.96,34.29 76.96,32.26 | IC4.1 70.1,51.66 70.1,50.8 70.04,50.8 R31.1 69.98,49.78 69.98,48.26 74.27,48.26 IC2.1 | M2:IC1.3 17.4,40.01 17.4,35.31 19.68,35.31 19.68,31.62
  Top 0.61: L1.1 80.64,59.18 80.64,55.37 82.55,55.37 C7.+ TP2.PP C5.1 | 74.27,49.78 IC2.1
  Top 1.016: X4.3 TP3.TP
!WA  (via drill 0.7)
  Top 0.406: M1:Q2H.3 60.2,40.39 60.2,41.66 M1:C2.2 61.98,41.91 61.98,43.05 67.44,43.05 67.44,40.01 M1:IC2.6
  Top 0.813: M1:Q2H.3 55.88,40.38 | 55.88,40.38 55.88,45.72 M1:Q2L.4 | X2.2 v60.96,13.97 | v60.96,34.29 55.88,34.29 55.88,40.38
  Bottom 0.406: v60.96,13.97 v60.96,34.29
!WB
  Top 0.406: M2:Q2H.3 30.1,23.12 30.1,21.84 M2:C2.2 28.07,21.59 28.07,20.45 22.23,20.45 22.23,23.5 M2:IC2.6
  Top 0.813: M2:Q2H.3 34.29,23.12 34.29,17.78 | M2:Q2L.4 34.29,17.78 | 34.29,17.78 X3.2
GND  (2 unrouted)
  pour Top: 0,91.44 91.44,91.44 91.44,0 0,0
GNDA
  Top 0.813: R8.1 TP32.TP TP31.TP R9.1
IA  (via drill 0.7)
  Top 0.406: M1:Q2L.3 58.17,48
  Top 0.61: M1:Q2L.3 58.1,48 R12.1
  Top 0.813: v58.17,45.59 58.14,45.62 M1:Q2L.3 | M1:Q1L.3 58.14,29.24 v58.17,29.11 67.31,29.11 R8.2
  Bottom 0.406: v58.17,29.11 v58.17,45.59
IA_KILL  (1 unrouted)
  Top 0.813: R29.2 P2.2.P
IAN  (1 unrouted)
  Top 0.406: U1.39 P18.P | C14.2 R16.1 26.67,64.96 | R14.2 26.67,64.96 | 26.67,64.96 P1.4.P
IAO  (1 unrouted)
  Top 0.406: U1.38 P29.P | R18.2 C14.1 R16.2 | 26.67,67.12 P1.3.P
  Top 0.813: R16.2 26.67,67.12
IAP
  Top 0.406: P28.P U1.40
IAREF
  Top 0.406: IC3.2 17.02,66.67 17.02,66.04 R24.1 18.03,66.04 18.03,64.77 20.13,64.77 R28.1 C19.1
  Top 0.813: P3.0.P C19.1
IB  (via drill 0.7)
  Top 0.406: v32.03,33.02 31.75,33.02
  Top 0.61: R13.1 v32.03,33.02
  Top 0.813: M2:Q1L.3 v32.03,33.02 32.03,31.24 52.45,31.24 52.45,32.51 63.25,32.51 63.25,34.29 R9.2 | M2:Q2L.3 32,15.5 v32,17.65
  Bottom 0.406: v32.03,33.02 32,31.75 v32,17.65
  Bottom 0.813: v32,17.65 32.03,17.65
IB_KILL  (1 unrouted)
  Top 0.61: R30.2 5.21,66.04
  Top 0.813: 5.21,66.04 P2.3.P
IBN  (1 unrouted)
  Top 0.406: U1.36 P30.P | C15.2 R17.1 26.67,71.31 | R15.2 26.67,71.31 | 26.67,71.31 P1.1.P
IBO  (1 unrouted)
  Top 0.406: U1.37 P19.P | R19.2 C15.1 R17.2 | 26.67,73.47 P1.2.P
  Top 0.813: R17.2 26.67,73.47
IBREF
  Top 0.406: IC3.6 8.38,67.94 8.38,68.58 R27.1 R26.1 C20.1
  Top 0.61: R26.1 7.49,71.12
  Top 0.813: 7.49,71.12 P3.1.P
ICP
  Top 0.406: U1.35 P20.P
M1:AH
  Top 0.406: M1:R2.1 64.45,17.78 65.41,17.78 65.41,16.51 M1:D1.C 67.31,16.51 67.31,17.14 M1:IC1.8
M1:AL
  Top 0.406: M1:R3.1 64.45,25.4 65.41,25.4 65.41,26.67 M1:D2.C 67.31,26.67 67.31,26.04 M1:IC1.1
M1:BH
  Top 0.406: M1:R4.2 64.45,38.1 65.41,38.1 65.41,36.83 M1:D3.C 67.82,36.83 67.82,37.47 M1:IC2.8
M1:BL
  Top 0.406: M1:R5.2 64.45,45.72 65.41,45.72 65.41,46.99 M1:D4.C 67.82,46.99 67.82,46.35 M1:IC2.1
M1:N$1
  Top 0.406: M1:C2.1 66.29,41.66 66.29,38.73 M1:IC2.7 72.88,38.73 M1:D6.C
M1:N$2
  Top 0.406: M1:C1.1 66.17,21.34 66.17,18.41 M1:IC1.7 72.88,18.41 M1:D5.C
M1:N$3
  Top 0.406: M1:IC1.14 80.26,23.5 80.26,23.37 81.53,23.37 81.53,23.62 M1:R1.2
M1:N$4
  Top 0.406: M1:IC1.12 81.53,20.95 81.53,20.83 M1:R6.2
M1:N$5
  Top 0.406: M1:R2.2 62.55,17.78 61.59,17.78 61.59,16.51 M1:D1.A 59.69,16.51 59.69,15.5 M1:Q1H.1
M1:N$6
  Top 0.406: M1:IC2.12 81.53,41.27 81.53,41.15 M1:R7.2
M1:N$7
  Top 0.406: M1:D2.A 61.59,26.67 61.59,25.4 62.55,25.4 M1:R3.2 60.33,24.13 60.33,23.12 M1:Q1L.1
M1:N$8
  Top 0.406: M1:IC2.14 81.53,43.81 81.53,43.94 M1:R8.2
M1:N$9
  Top 0.406: M1:R4.1 62.55,38.1 61.59,38.1 61.59,36.83 M1:D3.A 59.69,36.83 59.69,35.81 M1:Q2H.1
M1:N$11
  Top 0.406: M1:D4.A 61.59,46.99 61.59,45.72 62.55,45.72 M1:R5.1 60.2,44.45 60.2,43.44 M1:Q2L.1
M2:AH
  Top 0.406: M2:R2.1 25.72,45.72 24.64,45.72 M2:D1.C 22.73,46.99 22.73,46.35 M2:IC1.8
M2:AL
  Top 0.406: M2:R3.1 25.72,38.1 24.77,38.1 24.77,36.83 M2:D2.C 22.35,36.83 22.35,37.47 M2:IC1.1
M2:BH
  Top 0.406: M2:R4.2 25.72,25.4 24.77,25.4 24.77,26.67 M2:D3.C 22.23,26.67 22.23,26.04 M2:IC2.8
M2:BL
  Top 0.406: M2:R5.2 25.72,17.78 24.77,17.78 24.77,16.51 M2:D4.C 22.35,16.51 22.35,17.14 M2:IC2.1
M2:N$1
  Top 0.406: M2:C2.1 23.11,21.84 23.11,24.77 M2:IC2.7 17.27,24.77 17.27,29.21 M2:D6.C
M2:N$2
  Top 0.406: M2:C1.1 23.75,42.16 23.75,45.09 M2:IC1.7 15.24,45.09 15.24,33.53 M2:D5.C
M2:N$3
  Top 0.406: M2:R1.2 8.64,39.88 8.64,40.01 M2:IC1.14
M2:N$4
  Top 0.406: M2:R6.2 8.64,42.67 8.64,42.55 M2:IC1.12
M2:N$5
  Top 0.406: M2:R2.2 27.62,45.72 28.7,45.72 M2:D1.A 30.48,46.99 30.48,48.01 M2:Q1H.1
M2:N$6
  Top 0.406: M2:IC2.12 8.64,22.23 8.64,22.35 M2:R7.2
M2:N$7
  Top 0.406: M2:D2.A 28.57,36.83 28.57,38.1 27.62,38.1 M2:R3.2 29.84,39.37 29.84,40.38 M2:Q1L.1
M2:N$8
  Top 0.406: M2:IC2.14 8.64,19.68 8.64,19.56 M2:R8.2
M2:N$9
  Top 0.406: M2:R4.1 27.62,25.4 28.57,25.4 28.57,26.67 M2:D3.A 30.48,26.67 30.48,27.69 M2:Q2H.1
M2:N$11
  Top 0.406: M2:D4.A 28.57,16.51 28.57,17.78 27.62,17.78 M2:R5.1 30.1,19.05 30.1,20.06 M2:Q2L.1
N$1
  Top 0.406: R27.2 5.33,68.58 5.33,67.31 7.43,67.31 R30.1 8.38,66.04 8.38,66.67 IC3.7
N$2
  Top 0.406: SWD1.1 48.26,85.09 48.26,81.28 49.53,81.28 U1.5
N$3
  Top 0.406: R28.2 R29.1 16.32,64.64 15.24,64.64 15.24,65.41 IC3.1
N$4
  Top 0.406: U1.4 52.07,83.82 54.61,83.82 SWD1.3
N$5
  Top 0.406: IC3.3 17.02,67.94 17.02,68.58 R23.1
N$6
  Top 0.406: IC3.5 13.08,69.22 13.08,71.12 R25.1
N$7
  Top 0.406: SWD1.4 55.88,78.36 54.61,78.36 U1.3
N$8
  Top 0.61: R22.2 12.7,82.36 R21.A
N$9
  Top 0.61: R2.2 R3.2 R4.2 74.42,70.97 74.42,69.91 IC1.8 | IC1.7 IC1.8 | IC1.8 IC1.1
N$10
  Top 0.406: IC1.5 81.28,69.91 R5.2 R6.1
N$11
  Top 0.406: C6.1 78.11,66.99 IC1.3
N$12
  Top 0.406: R6.2 R7.1
N$13
  Top 0.61: D1.C 81.28,73.96 C3.1 79.12,73.98 79.12,74.3 C2.+ | IC1.6 78.11,72.26 76.2,72.26 C2.+ | C2.+ 74.3,74.3 74.3,73.81 R4.1 R3.1 R2.1
N$14
  Top 0.61: R20.1 7.62,82.36 R21.E
N$15
  Top 0.61: R1.2 D1.A
N$16
  Top 0.61: IC1.2 76.83,62.72 D2.C 72.39,59.31 74.74,59.31 L1.2
N$17
  Top 0.406: R18.1 C17.1 38.86,64.96 38.86,69.09 22.1,69.09 22.1,68.58 R23.2
N$18
  Top 0.406: R19.1 C18.1 36.83,69.85 22.1,69.85 22.1,71.12 R25.2
N$19
  Top 0.813: R12.2 P1.5.P
N$20
  Top 0.813: P1.0.P R13.2
N$21
  Top 0.813: P0.0.P M1:R6.1
N$22
  Top 0.406: IC4.3 72.14,51.66 72.14,50.8 72.2,50.8 R31.2
N$23
  Top 1.016: LED1.A R32.1
N$24
  Top 1.016: LED2.A R33.1
N$25
  Top 0.813: P0.1.P M1:R1.1
N$26
  Top 0.813: P0.2.P M1:R7.1
N$27
  Top 0.813: P0.3.P M1:R8.1
N$28
  Top 0.813: M2:R6.1 P3.4.P
N$29
  Top 0.813: M2:R1.1 P3.5.P
N$30
  Top 0.813: M2:R7.1 P3.6.P
N$31
  Top 0.406: P3.P U1.17
N$31.
  Top 0.813: M2:R8.1 P3.7.P
N$33
  Top 1.016: P57.P R32.2
N$34
  Top 1.016: P58.P R33.2
N$35
  Top 0.406: P1.P U1.21
N$36
  Top 0.406: P9.P U1.20
N$37
  Top 0.406: P2.P U1.19
N$38
  Top 0.406: P10.P U1.18
N$39
  Top 0.406: P11.P U1.16
N$40
  Top 0.406: P4.P U1.15
N$41
  Top 0.406: P12.P U1.14
N$42
  Top 0.406: P5.P U1.13
N$43
  Top 0.406: P13.P U1.12
N$44
  Top 0.406: P6.P U1.11
N$45
  Top 0.406: P14.P U1.10
N$46
  Top 0.406: P7.P U1.9
N$47
  Top 0.406: P15.P U1.8
N$48
  Top 0.406: P8.P U1.7
N$49
  Top 0.406: P16.P U1.6
N$50
  Top 0.406: U1.23 P26.P
N$51
  Top 0.406: U1.24 P36.P
N$52
  Top 0.406: U1.25 P25.P
N$53
  Top 0.406: U1.26 P35.P
N$54
  Top 0.406: U1.27 P24.P
N$55
  Top 0.406: U1.28 P34.P
N$56
  Top 0.406: U1.29 P23.P
N$57
  Top 0.406: U1.30 P33.P
N$58
  Top 0.406: U1.31 P22.P
N$59
  Top 0.406: U1.32 P32.P
N$60
  Top 0.406: U1.33 P21.P
N$61
  Top 0.406: U1.34 P31.P
N$63
  Top 1.016: P60.P X4.2
N$68
  Top 0.406: U1.41 P17.P
N$69
  Top 0.406: U1.42 P27.P
SPEED
  Top 0.61: R21.S 15.24,87.63 C16.1
  Top 0.813: P2.1.P 15.24,87.63
VB
  Top 0.406: 81.28,87.63 R10.2
  Top 1.27: M1:Q2H.4 TP26.TP 45.21,45.72 | M2:Q2H.4 45.21,25.4 TP28.TP | M2:Q1H.4 45.21,45.72 | TP28.TP M1:Q1H.4 | TP28.TP 45.21,4.7 67.69,4.7 67.69,6.6 TP27.TP 74.93,6.6 | 45.09,2.92 45.09,2.29 15.24,2.29 C12.+ 10.16,6.35 TP29.TP 10.16,13.97 1.27,13.97 1.27,50.8 45.21,50.8 45.21,45.72 | 45.09,2.92 TP30.TP | 45.09,2.92 74.93,2.92 C11.+
  Top 1.422: TP25.TP X1.1 73.66,87.63 81.28,87.63 R1.1 90.2,87.63 90.2,1.02 45.09,1.02 45.09,2.29 | 74.93,6.6 C11.+
VBUS
  Top 0.406: R10.1 R11.2 C13.1
  Top 0.813: P2.0.P C13.1
VDD
  Top 0.406: U1.1 59.69,78.36 57.15,78.36 57.15,80.14 | 57.15,80.14 SWD1.5 | C1.1 9.53,63.5 | C4.1 57.15,80.14 | IC4.5 70.23,54.26 70.23,55.64
  Top 0.61: IC3.8 9.53,65.41 9.53,63.5 9.53,58.42 | 9.53,58.42 6.35,58.42 | 6.35,58.42 U1.44 | 9.53,58.42 49.53,58.42 49.53,64.77 59.69,64.77 | 59.69,64.77 U1.1 | R20.2 5.08,78.74 2.54,78.74 2.54,58.42 6.35,58.42 | IC2.3 74.3,55.64 70.23,55.64 69.85,55.64 C9.1 | C9.1 | C9.1 67.12,57.02 C21.1 66.99,59.69 66.04,59.69 TP1.PP C10.+ 59.69,64.77
WA
  Top 0.406: M1:Q1H.3 60.33,20.06 60.33,21.34 M1:C1.2 62.23,21.59 62.23,22.73 67.44,22.73 67.44,19.68 M1:IC1.6
  Top 0.813: M1:Q1H.3 55.88,20.06 | 55.88,20.06 55.88,25.4 M1:Q1L.4 | 55.88,20.06 X2.1
WB  (via drill 0.7)
  Top 0.406: M2:Q1H.3 30.48,43.43 30.48,42.16 M2:C1.2 27.94,42.16 27.94,40.77 22.86,40.77 22.86,43.81 M2:IC1.6
  Top 0.813: M2:Q1H.3 34.29,43.44 34.29,38.1 M2:Q1L.4 41.87,38.1 v41.91,33.78 | X3.1 29.21,4.83 37.34,4.83 37.34,12.7 v41.91,12.7
  Bottom 0.406: v41.91,12.7 v41.91,33.78